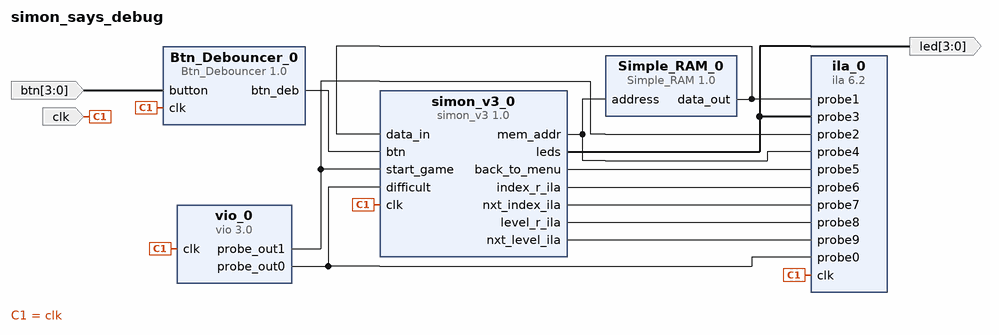
[diagram p0: block diagram of the top level]
# Vivado block design simon_says_debug, xc7z010clg400-1, Vivado 2020.1
create_bd_design simon_says_debug

create_bd_port -dir I -type clk clk
create_bd_port -dir I -from 3 -to 0 btn
create_bd_port -dir O -from 3 -to 0 led

create_bd_cell -type ip -vlnv xilinx.com:user:Btn_Debouncer:1.0 Btn_Debouncer_0
create_bd_cell -type ip -vlnv xilinx.com:ip:ila:6.2 ila_0
set_property -dict [list \
  CONFIG.C_ENABLE_ILA_AXI_MON false \
  CONFIG.C_MONITOR_TYPE Native \
  CONFIG.C_NUM_OF_PROBES 10 \
  CONFIG.C_PROBE0_WIDTH 2 \
  CONFIG.C_PROBE1_WIDTH 4 \
  CONFIG.C_PROBE3_WIDTH 4 \
  CONFIG.C_PROBE4_WIDTH 5 \
  CONFIG.C_PROBE6_WIDTH 5 \
  CONFIG.C_PROBE7_WIDTH 5 \
  CONFIG.C_PROBE8_WIDTH 6 \
  CONFIG.C_PROBE9_WIDTH 6 \
] [get_bd_cells ila_0]
create_bd_cell -type ip -vlnv xilinx.com:ip:vio:3.0 vio_0
set_property -dict {CONFIG.C_NUM_PROBE_IN 0 CONFIG.C_NUM_PROBE_OUT 2 CONFIG.C_PROBE_OUT0_WIDTH 2} [get_bd_cells vio_0]
create_bd_cell -type ip -vlnv xilinx.com:user:simon_v3:1.0 simon_v3_0
create_bd_cell -type ip -vlnv xilinx.com:user:Simple_RAM:1.0 Simple_RAM_0

# ---- connections ----

connect_bd_net [get_bd_pins Simple_RAM_0/data_out] [get_bd_pins ila_0/probe1] [get_bd_pins simon_v3_0/data_in]
connect_bd_net -net clk_0_1 [get_bd_ports clk] \
  [get_bd_pins Btn_Debouncer_0/clk] [get_bd_pins ila_0/clk] [get_bd_pins vio_0/clk] [get_bd_pins simon_v3_0/clk]
connect_bd_net -net button_0_1 [get_bd_ports btn] [get_bd_pins Btn_Debouncer_0/button]
connect_bd_net -net simon_says_0_mem_addr [get_bd_pins simon_v3_0/mem_addr] [get_bd_pins ila_0/probe4] [get_bd_pins Simple_RAM_0/address]
connect_bd_net -net simon_says_0_leds [get_bd_pins simon_v3_0/leds] [get_bd_ports led] [get_bd_pins ila_0/probe3]
connect_bd_net [get_bd_pins vio_0/probe_out1] [get_bd_pins ila_0/probe2] [get_bd_pins simon_v3_0/start_game]
connect_bd_net [get_bd_pins vio_0/probe_out0] [get_bd_pins ila_0/probe0] [get_bd_pins simon_v3_0/difficult]
connect_bd_net [get_bd_pins Btn_Debouncer_0/btn_deb] [get_bd_pins simon_v3_0/btn]
connect_bd_net [get_bd_pins simon_v3_0/back_to_menu] [get_bd_pins ila_0/probe5]
connect_bd_net [get_bd_pins simon_v3_0/index_r_ila] [get_bd_pins ila_0/probe6]
connect_bd_net [get_bd_pins simon_v3_0/nxt_index_ila] [get_bd_pins ila_0/probe7]
connect_bd_net [get_bd_pins simon_v3_0/level_r_ila] [get_bd_pins ila_0/probe8]
connect_bd_net [get_bd_pins simon_v3_0/nxt_level_ila] [get_bd_pins ila_0/probe9]

validate_bd_design
save_bd_design
